# Altium schematic sheet Microcontroller Schematic.SchDoc
size A3; SheetNumber: 3; SheetTotal: 3
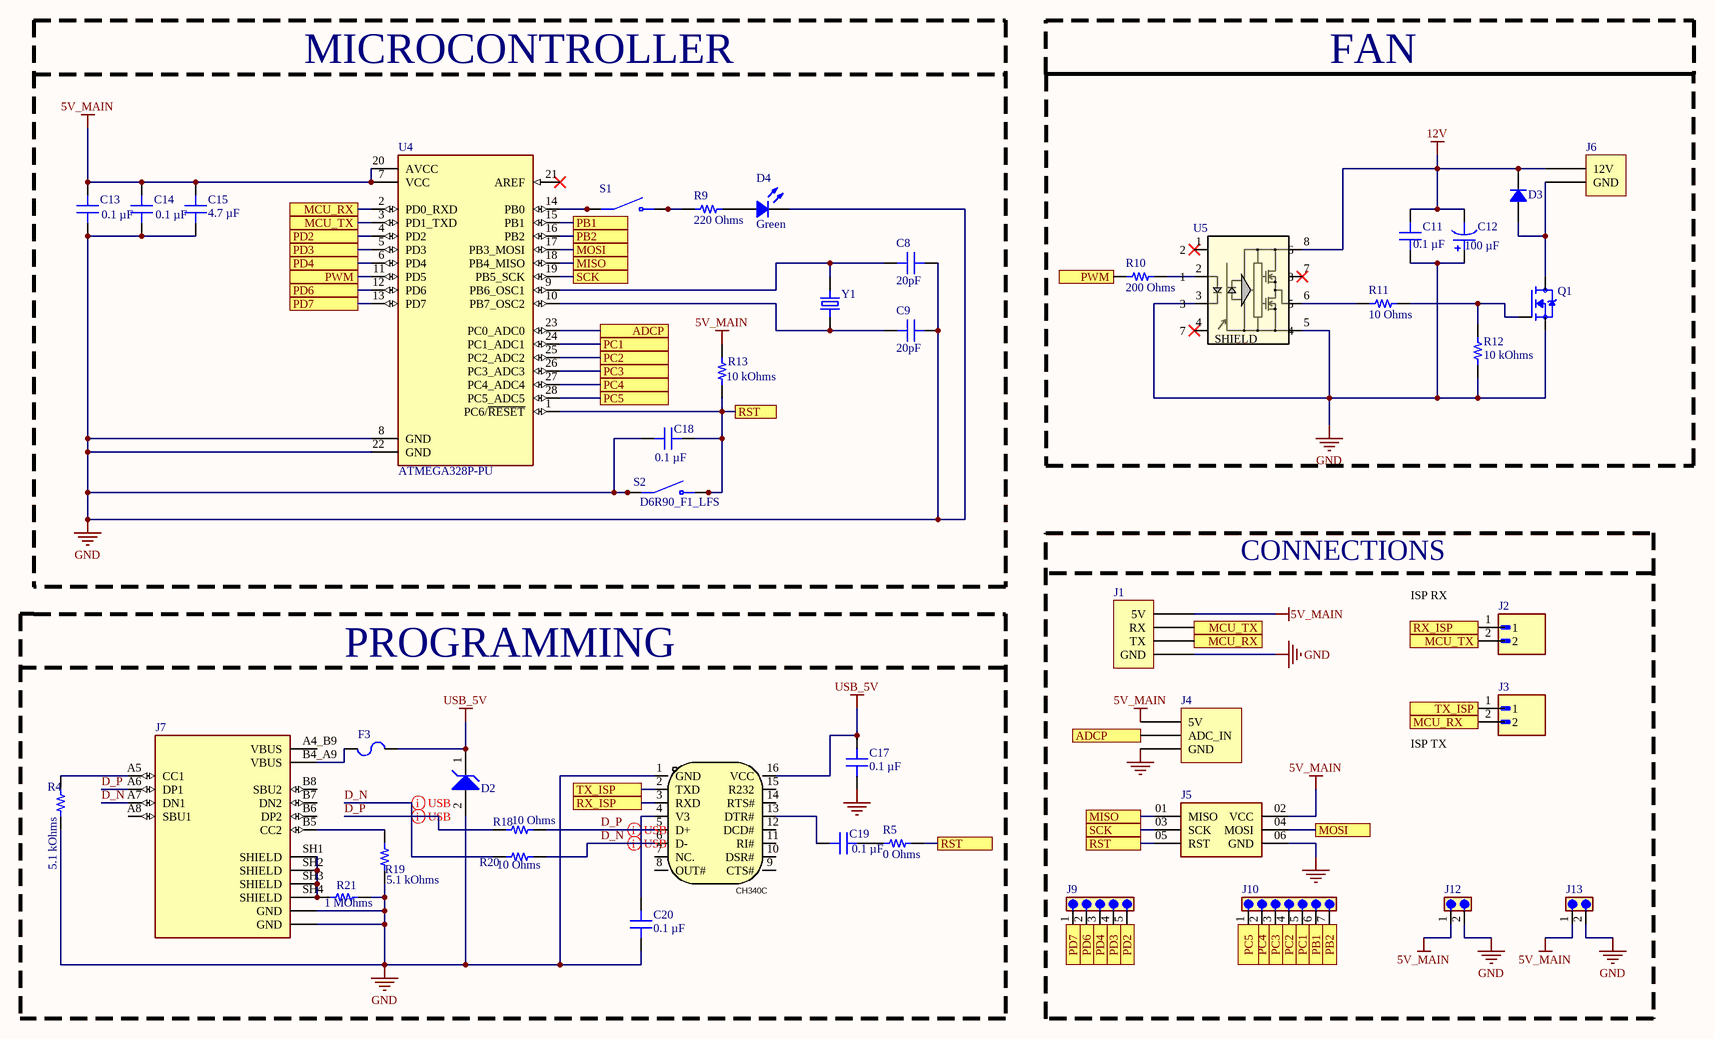
[diagram p0: Microcontroller Schematic.SchDoc]

## Parts
C8  20pF  [CAP 0603_1608]
C9  20pF  [CAP 0603_1608]
C11  0.1 µF  [CAP 0603_1608]
C12  100 µF  [CAP TH ALUM ELEC D8.00mm S3.50mm H16.50mm]
C13  0.1 µF  [CAP 0603_1608]
C14  0.1 µF  [CAP 0603_1608]
C15  4.7 µF  [CAP 0603_1608]
C17  0.1 µF  [CAP 0603_1608]
C18  0.1 µF  [CAP 0603_1608]
C19  0.1 µF  [CAP 0603_1608]
C20  0.1 µF  [CAP 0603_1608]
D2  400W, 5VDC  [WE-TVSP_DO-214AC_Unidirectional]  (value not drawn)
D3  1N4007FLTR  [SOD123F]  (value not drawn)
D4  Green  [LED 0603_1608 GREEN]
F3  SF-1206S300-2  [FUSE 0402_1005 0.51MM]  (value not drawn)
J1  B4B-XH-A(LF)(SN)  [JST XH B4B-XH-A]  (value not drawn)
J2  M20-9990246  [HARWIN_M20-9990246]  (value not drawn)
J3  M20-9990246  [HARWIN_M20-9990246]  (value not drawn)
J4  B3B-XH-A(LF)(SN)  [JST XH B3B-XH-A]  (value not drawn)
J5  TST-103-01-L-D  [SAMTEC_TST-103-01-L-D]  (value not drawn)
J6  B2B-XH-A(LF)(SN)  [JST XH B2B-XH-A]  (value not drawn)
J7  10155435-00011LF  [AMPHENOL_10155435-00011LF]  (value not drawn)
J9  6130XX11121_61300511121  [61300511121]  (value not drawn)
J10  6130XX11121_61300711121  [61300711121]  (value not drawn)
J12  6130XX11121_61300211121  [61300211121]  (value not drawn)
J13  6130XX11121_61300211121  [61300211121]  (value not drawn)
Q1  IRFZ44NSTRLPBF  [DPAK254P1524X483-3N]  (value not drawn)
R4  5.1 kOhms  [YAGEO RES 0603_1608]
R5  0 Ohms  [YAGEO RES 0603_1608]
R9  220 Ohms  [YAGEO RES 0805_2012]
R10  200 Ohms  [YAGEO RES 0603_1608]
R11  10 Ohms  [YAGEO RES 0603_1608]
R12  10 kOhms  [YAGEO RES 0603_1608]
R13  10 kOhms  [YAGEO RES 0603_1608]
R18  10 Ohms  [YAGEO RES 0603_1608]
R19  5.1 kOhms  [YAGEO RES 0603_1608]
R20  10 Ohms  [YAGEO RES 0603_1608]
R21  1 MOhms  [YAGEO RES 0603_1608]
S1  D6R90_F1_LFS  [SW_D6R90_F1_LFS]  (value not drawn)
S2  D6R90_F1_LFS  [SW_D6R90_F1_LFS]
U4  ATMEGA328P-PU  [DIP794W46P254L2967H457Q28B - duplicate]
U5  TLP250H(F)  [DIP8_TOS]  (value not drawn)
U7  CH340C  [CH340C]
Y1  ECS-160-20-5PX-TR  [XTAL_ECS-160-20-5PX-TR]  (value not drawn)

## Blocks framed on the sheet
MICROCONTROLLER: C8 C9 C13-C15 C18 D4 R9 R13 S1 S2 U4 Y1
FAN: C11 C12 D3 J6 Q1 R10-R12 U5
CONNECTIONS: J1-J5 J9 J10 J12 J13
PROGRAMMING: C17 C19 C20 D2 F3 J7 R4 R5 R18-R21 U7

## Ports
ADCP (see Microcontroller Schematic[3A]), ADCP (see Microcontroller Schematic[5C]), MCU_RX (see Microcontroller Schematic[2A], Microcontroller Schematic[5B]), MCU_RX (see Microcontroller Schematic[2A], Microcontroller Schematic[6C]), MCU_RX (see Microcontroller Schematic[5B], Microcontroller Schematic[6C]), MCU_TX (see Microcontroller Schematic[2A], Microcontroller Schematic[5B]), MCU_TX (see Microcontroller Schematic[2A], Microcontroller Schematic[6B]), MCU_TX (see Microcontroller Schematic[5B], Microcontroller Schematic[6B]), MISO (see Microcontroller Schematic[3A]), MISO (see Microcontroller Schematic[5C]), MOSI (see Microcontroller Schematic[3A]), MOSI (see Microcontroller Schematic[6C]), PB1 (see Microcontroller Schematic[3A]), PB1 (see Microcontroller Schematic[6C]), PB2 (see Microcontroller Schematic[3A]), PB2 (see Microcontroller Schematic[6C]), PC1 (see Microcontroller Schematic[3B]), PC1 (see Microcontroller Schematic[6C]), PC2 (see Microcontroller Schematic[3B]), PC2 (see Microcontroller Schematic[6C]), PC3 (see Microcontroller Schematic[3B]), PC3 (see Microcontroller Schematic[6C]), PC4 (see Microcontroller Schematic[3B]), PC4 (see Microcontroller Schematic[6C]), PC5 (see Microcontroller Schematic[3B]), PC5 (see Microcontroller Schematic[6C]), PD2 (see Microcontroller Schematic[2A]), PD2 (see Microcontroller Schematic[5C]), PD3 (see Microcontroller Schematic[2A]), PD3 (see Microcontroller Schematic[5C]), PD4 (see Microcontroller Schematic[2A]), PD4 (see Microcontroller Schematic[5C]), PD6 (see Microcontroller Schematic[2A]), PD6 (see Microcontroller Schematic[5C]), PD7 (see Microcontroller Schematic[2A]), PD7 (see Microcontroller Schematic[5C]), PWM (see Microcontroller Schematic[2A]), PWM (see Microcontroller Schematic[5A]), RST (see Microcontroller Schematic[4B], Microcontroller Schematic[4C]), RST (see Microcontroller Schematic[4B], Microcontroller Schematic[5C]), RST (see Microcontroller Schematic[4C], Microcontroller Schematic[5C]), RX_ISP (see Microcontroller Schematic[3C]), RX_ISP (see Microcontroller Schematic[6B]), SCK (see Microcontroller Schematic[3A]), SCK (see Microcontroller Schematic[5C]), TX_ISP (see Microcontroller Schematic[3C]), TX_ISP (see Microcontroller Schematic[6B])

## Nets
5V_MAIN: C13.2 C14.2 C15.2 J1.1(5V) J4.1(5V) J5.02(VCC) J12.1 J13.1 R13.2 U4.7(VCC) U4.20(AVCC)
12V: C11.2 C12.2 D3.2 J6.1(12V) U5.8(6)
GND: C8.2 C9.2 C11.1 C12.1 C13.1 C14.1 C15.1 C17.2 C18.2 C20.1 D2.2(A) D4.2 J1.4(GND) J4.3(GND) J5.06(GND) J7.A1_B12(GND) J7.B1_A12(GND) J12.2 J13.2 Q1.3(S) R4.1 R12.1 R19.1 R21.2 S2.1(COM) S2.2(COM) U4.8(GND) U4.22(GND) U5.3 U5.5(4) U7.1(GND)
USB_5V: C17.1 D2.1(K) F3.2 U7.16(VCC)
ADCP: J4.2(ADC_IN) U4.23(PC0_ADC0) ; port ADCP
D_N: J7.A7(DN1) R20.1 R20.2 U7.6(D-)
D_P: J7.A6(DP1) R18.1 R18.2 U7.5(D+)
MCU_RX: J1.3(TX) J3.2 U4.2(PD0_RXD) ; port MCU_RX
MCU_TX: J1.2(RX) J2.2 U4.3(PD1_TXD) ; port MCU_TX
MISO: J5.01(MISO) U4.18(PB4_MISO) ; port MISO
MOSI: J5.04(MOSI) U4.17(PB3_MOSI) ; port MOSI
PB1: J10.6 U4.15(PB1) ; port PB1
PB2: J10.7 U4.16(PB2) ; port PB2
PC1: J10.5 U4.24(PC1_ADC1) ; port PC1
PC2: J10.4 U4.25(PC2_ADC2) ; port PC2
PC3: J10.3 U4.26(PC3_ADC3) ; port PC3
PC4: J10.2 U4.27(PC4_ADC4) ; port PC4
PC5: J10.1 U4.28(PC5_ADC5) ; port PC5
PD2: J9.5 U4.4(PD2) ; port PD2
PD3: J9.4 U4.5(PD3) ; port PD3
PD4: J9.3 U4.6(PD4) ; port PD4
PD6: J9.2 U4.12(PD6) ; port PD6
PD7: J9.1 U4.13(PD7) ; port PD7
PWM: R10.1 U4.11(PD5) ; port PWM
RST: C18.1 J5.05(RST) R5.2 R13.1 S2.3(NO) S2.4(NO) U4.1(PC6/~{RESET}) ; port RST
RX_ISP: J2.1 U7.3(RXD) ; port RX_ISP
SCK: J5.03(SCK) U4.19(PB5_SCK) ; port SCK
TX_ISP: J3.1 U7.2(TXD) ; port TX_ISP
NetC8_1: C8.1 U4.9(PB6_OSC1) Y1.2
NetC9_1: C9.1 U4.10(PB7_OSC2) Y1.1
NetC19_1: C19.1 R5.1
NetC19_2: C19.2 U7.13(DTR#)
NetC20_2: C20.2 U7.4(V3)
NetD3_1: D3.1 J6.2(GND) Q1.2(D)
NetD4_1: D4.1 R9.2
NetF3_1: F3.1 J7.B4_A9(VBUS)
NetJ7_A5: J7.A5(CC1) R4.2
NetJ7_B5: J7.B5(CC2) R19.2
NetJ7_SH1: J7.SH1(SHIELD) J7.SH2(SHIELD) J7.SH3(SHIELD) J7.SH4(SHIELD) R21.1
NetQ1_1: Q1.1(G) R11.2 R12.2
NetR9_1: R9.1 S1.3(NO) S1.4(NO)
NetR10_2: R10.2 U5.2(1)
NetR11_1: R11.1 U5.6(5)
NetS1_1: S1.1(COM) S1.2(COM) U4.14(PB0)

Not connected (* = marked no-connect by the designer): J7 A4_B9(VBUS) A8(SBU1) B6(DP2) B7(DN2) B8(SBU2); U4 21(AREF)*; U5 1(2)* 4(7)* 7(8)*; U7 7(NC.) 8(OUT#) 9(CTS#) 10(DSR#) 11(RI#) 12(DCD#) 14(RTS#) 15(R232)

## Layout directives
differential pair: D_N, D_P

## Notes on the sheet
- (near J2) ISP RX
- (near J3) ISP TX
- (in symbol TLP250HF) SHIELD

## Library data of the parts
C8 C9 = 06033A200JAT2A: CAP CER 20PF 25V C0G/NP0 0603; manufacturer: AVX Corporation; Temperature Coefficient: C0G, NP0; Tolerance: ±5%; Part Number: 06033A200JAT2A; Applications: General Purpose; componentlink1description: Datasheet; componentlink1url: http://datasheets.avx.com/C0GNP0-Dielectric.pdf; componentlink2description: DigiKey Link; componentlink2url: http://digikey.com/product-detail/en/avx-corporation/06033A200JAT2A/478-11802-1-ND/8573438; Device Package: 0603 (1608 Metric); lastupdated: 2.09.2020 01:03:34; Lifecycle Status: Active; Minimum Order: 1; Mounting Type: Surface Mount, MLCC; Operating Temperature: -55°C ~ 125°C; Package / Case: 0603 (1608 Metric); packaging: TapeAndReel; partid: 3067; Part Status: Active; price: 0.04; series: -; Size / Dimension: 0.063" L x 0.032" W (1.60mm x 0.81mm); Supplier 1: DigiKey; Supplier Part Number 1: 478-11802-1-ND; Thickness (Max): 0.035" (0.90mm); value: 20pF; Voltage - Rated: 25V; Capacitance: 20pF
C11 C13 C14 C17-C20 = C0603X104M3RAC7867: CAP CER 0.1UF 25V X7R 0603; manufacturer: KEMET; Tolerance: ±20%; Part Number: C0603X104M3RAC7867; Applications: Boardflex Sensitive; componentlink1description: Datasheet; componentlink1url: https://api.kemet.com/component-edge/download/datasheet/C0603X104M3RACTU.pdf; componentlink2description: DigiKey Link; componentlink2url: https://www.digikey.com/en/products/detail/kemet/C0603X104M3RAC7867/2202613; Device Package: 0603 (1608 Metric); Features: Soft Termination; lastupdated: 9.02.2024 20:10:30; Lifecycle Status: Active; Minimum Order: 1; Mounting Type: Surface Mount, MLCC; Operating Temperature: -55°C ~ 125°C; Package / Case: 0603 (1608 Metric); packaging: TapeAndReel; partid: 2484; Part Status: Active; price: 0.06; series: SMD Comm X7R Flex; Size / Dimension: 0.063" L x 0.031" W (1.60mm x 0.80mm); Supplier 1: DigiKey; Supplier Part Number 1: 399-13148-1-ND; Temperature Coefficient: X7R; Thickness (Max): 0.034" (0.87mm); value: 0.1 µF; Voltage - Rated: 25V; Capacitance: 0.1 µF
C12 = EEU-TA1E101: CAP ALUM 100UF 20% 25V RADIAL; manufacturer: Panasonic Electronic Components; Impedance: 130 mOhms; Lifetime @ Temp.: 2000 Hrs @ 125°C; Polarization: Polar; Ripple Current @ High Frequency: 500 mA @ 100 kHz; Ripple Current @ Low Frequency: 325 mA @ 120 Hz; Part Number: EEU-TA1E101; Applications: General Purpose; Capacitance: 100 µF; componentlink1description: Datasheet; componentlink1url: http://industrial.panasonic.com/www-cgi/jvcr13pz.cgi?E+PZ+3+ABA0028+EEUTA1E101+8+WW; componentlink2description: DigiKey Link; componentlink2url: https://www.digikey.com/en/products/detail/panasonic-electronic-components/EEU-TA1E101/2689893; Device Package: Radial, Can; Height - Seated (Max): 0.492" (12.50mm); lastupdated: 3.06.2024 20:06:12; Lead Spacing: 0.138" (3.50mm); Lifecycle Status: Active; Minimum Order: 1; Mounting Type: Through Hole; Operating Temperature: -40°C ~ 125°C; Package / Case: Radial, Can; packaging: Bulk; partid: 7202; Part Status: Active; price: 0.25; series: TA; Size / Dimension: 0.315" Dia (8.00mm); Supplier 1: DigiKey; Supplier Part Number 1: P19501-ND; Tolerance: ±20%; value: 100 µF; Voltage - Rated: 25 V
C15 = CL10A475KA8NQNC: CAP CER 4.7UF 25V X5R 0603; manufacturer: Samsung Electro-Mechanics; Tolerance: ±10%; Part Number: CL10A475KA8NQNC; Applications: General Purpose; componentlink1description: Datasheet; componentlink1url: http://www.samsungsem.com/kr/support/product-search/mlcc/CL10A475KA8NQNC.jsp; componentlink2description: DigiKey Link; componentlink2url: https://www.digikey.com/en/products/detail/samsung-electro-mechanics/CL10A475KA8NQNC/3887558; Device Package: 0603 (1608 Metric); lastupdated: 9.02.2024 20:10:30; Lifecycle Status: Active; Minimum Order: 1; Mounting Type: Surface Mount, MLCC; Operating Temperature: -55°C ~ 85°C; Package / Case: 0603 (1608 Metric); packaging: TapeAndReel; partid: 2349; Part Status: Active; price: 0.06; series: CL; Size / Dimension: 0.063" L x 0.031" W (1.60mm x 0.80mm); Supplier 1: DigiKey; Supplier Part Number 1: 1276-1900-1-ND; Temperature Coefficient: X5R; Thickness (Max): 0.035" (0.90mm); value: 4.7 µF; Voltage - Rated: 25V; Capacitance: 4.7 µF
D2 = 824500500: WE-TVSP SMT Power TVS Diode, DO-214AC, Unidirectional, 400W, 5VDC; Manufacturer: Wurth Elektronik; Clamping Voltage: 9.2V; Operating Voltage (DC): 5V; (Reverse) Breakdown Voltage: 6.7V; (Reverse) Peak Pulse Current: 43.5A; ComponentLink1Description: Website Link; ComponentLink1URL: https://www.we-online.com/redexpert/article/824500500?ad; ComponentLink2Description: Datasheet Link; ComponentLink2URL: https://www.we-online.com/redexpert/spec/824500500?ad; Manufacturer Part Number: 824500500; Category: Surge Protection; Match Code: WE-TVSP; Mount: Surface Mount; Operating Temperature Max: 150°C; Operating Temperature Min: -65°C; Packaging: Tape and Reel; Case/Size Code: DO-214AC; Length: 4.24mm; Width: 2.67mm; Height: 2.25mm; Polarity: Unidirectional; Power Dissipation: 400W
D3 = 1N4007FLTR: STANDARD RECTIFIER 1000V SOD-123; Manufacturer: SMC Diode Solutions; Capacitance @ Vr, F: 15pF @ 4V, 1MHz; Current - Average Rectified (Io): 1A; Current - Reverse Leakage @ Vr: 5µA @ 1000V; Speed: Standard Recovery >500ns, > 200mA (Io); Voltage - Forward (Vf) (Max) @ If: 1.1V @ 1A; Part Number: 1N4007FLTR; ComponentLink1Description: Datasheet; ComponentLink1URL: http://www.smc-diodes.com/propdf/1N4001FL-1N4007FL%20N1646%20REV.A.pdf; ComponentLink2Description: DigiKey Link; ComponentLink2URL: http://digikey.com/product-detail/en/smc-diode-solutions/1N4007FLTR/1655-1N4007FLCT-ND/11657827; Diode Type: Standard; LastUpdated: 30.08.2020 20:59:55; Lifecycle Status: Active; Minimum Order: 1; Mounting Type: Surface Mount; Package / Case: SOD-123F; Packaging: TapeAndReel; PartId: 3314; Price: 0.01; Supplier 1: DigiKey; Supplier Part Number 1: 1655-1N4007FLCT-ND; Supplier Device Package: SOD-123FL; Voltage - DC Reverse (Vr) (Max): 1000V
D4 = LT Q99G.01-R2T1-25-1: NEXT GENERATION OF CHIP LED 0603; Manufacturer: ams-OSRAM USA Inc.; Current - Test: 5mA; Lens Color: Colorless; Lens Size: 1.10mm x 0.80mm; Lens Style: Rectangle with Flat Top; Lens Transparency: Clear; Millicandela Rating: 247.5mcd; Viewing Angle: 140°; Voltage - Forward (Vf) (Typ): 2.9V; Wavelength - Dominant: 530nm; Wavelength - Peak: 518nm; Part Number: LT Q99G.01-R2T1-25-1; Color: Green; ComponentLink2Description: DigiKey Link; ComponentLink2URL: https://www.digikey.com/en/products/detail/ams-osram-usa-inc/LT-Q99G-01-R2T1-25-1/21556499; Device Package: 0603 (1608 Metric); Height (Max): 0.75mm; LastUpdated: 3.06.2024 19:58:39; Lifecycle Status: Active; Minimum Order: 1; Mounting Type: Surface Mount; Package / Case: 0603 (1608 Metric); Packaging: TapeAndReel; PartId: 1419; Price: 0.03; Series: Chip LED 0603; Size / Dimension: 1.60mm L x 0.80mm W; Supplier 1: DigiKey; Supplier Part Number 1: 475-LTQ99G.01-R2T1-25-1CT-ND; Supplier Device Package: 0603; Value: Green
F3 = SF-1206S300-2: FUSE BOARD MOUNT 3A 32VDC 1206; Part Number: SF-1206S300-2
J1 = B4B-XH-A(LF)(SN): CONN HEADER VERT 4POS 2.5MM; Manufacturer: JST Sales America Inc.; Contact Length - Post: 0.134" (3.40mm); Current Rating (Amps): 3A; Material Flammability Rating: UL94 V-0; Number of Positions: 4; Number of Positions Loaded: All; Pitch - Mating: 0.098" (2.50mm); Shrouding: Shrouded - 4 Wall; Style: Board to Cable/Wire; Voltage Rating: 250V; Part Number: B4B-XH-A(LF)(SN); ComponentLink1Description: Datasheet; ComponentLink1URL: http://www.jst-mfg.com/product/pdf/eng/eXH.pdf; ComponentLink2Description: DigiKey Link; ComponentLink2URL: http://digikey.com/product-detail/en/jst-sales-america-inc/B4B-XH-A-LF-SN/455-2249-ND/1651047; Connector Type: Header; Contact Finish - Mating: Tin; Contact Finish - Post: Tin; Contact Material: Brass; Contact Shape: Square; Contact Type: Male Pin; Fastening Type: Detent Lock; Insulation Color: Natural; Insulation Height: 0.276" (7.00mm); Insulation Material: Polyamide (PA66), Nylon 6/6; LastUpdated: 12.01.2020 23:46:34; Lifecycle Status: Active; Minimum Order: 1; Mounting Type: Through Hole; Number of Rows: 1; Operating Temperature: -25°C ~ 85°C; Packaging: Bulk; PartId: 69; Part Status: Active; Price: 0.21; Series: XH; Supplier 1: DigiKey; Supplier Part Number 1: 455-2249-ND; Termination: Press-Fit, Solder
J2 J3 = M20-9990246: 2.54mm (0.1) Pitch SIL Vertical Throughboard Pin Header, 6.1mm mating pin height, tin, 2 contacts; MF: Harwin; SnapEDA_Link: https://www.snapeda.com/parts/M20-9990246/Harwin/view-part/?ref=snap; Package: None; Value: *; MP: M20-9990246; Check_prices: https://www.snapeda.com/parts/M20-9990246/Harwin/view-part/?ref=eda
J4 = B3B-XH-A(LF)(SN): CONN HEADER VERT 3POS 2.5MM; Manufacturer: JST Sales America Inc.; Contact Length - Post: 0.134" (3.40mm); Current Rating (Amps): 3A; Material Flammability Rating: UL94 V-0; Number of Positions: 3; Number of Positions Loaded: All; Pitch - Mating: 0.098" (2.50mm); Shrouding: Shrouded - 4 Wall; Style: Board to Cable/Wire; Voltage Rating: 250V; Part Number: B3B-XH-A(LF)(SN); ComponentLink1Description: Datasheet; ComponentLink1URL: http://www.jst-mfg.com/product/pdf/eng/eXH.pdf; ComponentLink2Description: DigiKey Link; ComponentLink2URL: http://digikey.com/product-detail/en/jst-sales-america-inc/B3B-XH-A-LF-SN/455-2248-ND/1651046; Connector Type: Header; Contact Finish - Mating: Tin; Contact Finish - Post: Tin; Contact Material: Brass; Contact Shape: Square; Contact Type: Male Pin; Fastening Type: Detent Lock; Insulation Color: Natural; Insulation Height: 0.276" (7.00mm); Insulation Material: Polyamide (PA66), Nylon 6/6; LastUpdated: 12.01.2020 23:46:22; Lifecycle Status: Active; Minimum Order: 1; Mounting Type: Through Hole; Number of Rows: 1; Operating Temperature: -25°C ~ 85°C; Packaging: Bulk; PartId: 68; Part Status: Active; Price: 0.19; Series: XH; Supplier 1: DigiKey; Supplier Part Number 1: 455-2248-ND; Termination: Press-Fit, Solder
J5 = TST-103-01-L-D: Connector Header Through Hole 6 position 0.100 _2.54mm_; MF: Samtec; MP: TST-103-01-L-D; SnapEDA_Link: https://www.snapeda.com/parts/TST-103-01-L-D/Samtec/view-part/3264916/?ref=snap; Value: *; Package: None; Price: None; Availability: Unavailable; Toby_UK-Purchase-URL: https://snapeda.com/shop?store=Toby+UK&id=3264916
J6 = B2B-XH-A(LF)(SN): CONN HEADER VERT 2POS 2.5MM; Manufacturer: JST Sales America Inc.; Contact Length - Post: 0.134" (3.40mm); Current Rating (Amps): 3A; Material Flammability Rating: UL94 V-0; Number of Positions: 2; Number of Positions Loaded: All; Pitch - Mating: 0.098" (2.50mm); Shrouding: Shrouded - 4 Wall; Style: Board to Cable/Wire; Voltage Rating: 250V; Part Number: B2B-XH-A(LF)(SN); ComponentLink1Description: Datasheet; ComponentLink1URL: http://www.jst-mfg.com/product/pdf/eng/eXH.pdf; ComponentLink2Description: DigiKey Link; ComponentLink2URL: http://digikey.com/product-detail/en/jst-sales-america-inc/B2B-XH-A-LF-SN/455-2247-ND/1651045; Connector Type: Header; Contact Finish - Mating: Tin; Contact Finish - Post: Tin; Contact Material: Brass; Contact Shape: Square; Contact Type: Male Pin; Fastening Type: Detent Lock; Insulation Color: Natural; Insulation Height: 0.276" (7.00mm); Insulation Material: Polyamide (PA66), Nylon 6/6; LastUpdated: 12.01.2020 23:46:08; Lifecycle Status: Active; Minimum Order: 1; Mounting Type: Through Hole; Number of Rows: 1; Operating Temperature: -25°C ~ 85°C; Packaging: Bulk; PartId: 67; Part Status: Active; Price: 0.15; Series: XH; Supplier 1: DigiKey; Supplier Part Number 1: 455-2247-ND; Termination: Press-Fit, Solder
J7 = 10155435-00011LF: USB-C (USB TYPE-C) Receptacle Connector 24 (16+8 Dummy) Position Surface Mount, Right Angle; Manufacturer: AMPHENOL ICC (FCI); Package: None; Price: None; Value: *; MP: 10155435-00011LF; Availability: Unavailable; Supplier 1: Newark; Manufacturer Part Number: 10155435-00011LF; RoHS: No; Supplier Part Number 1: 04AJ5525
J9 = 6130XX11121_61300511121: MF: {'manufacturer': u'W\xfcrth Elektronik'}; Package: None; Price: None; Value: *; MP: 61300511121; Availability: Unavailable
J10 = 6130XX11121_61300711121: MF: {'manufacturer': u'Wurth Electronics'}; Package: None; Price: None; Value: *; MP: 61300711121; Availability: Unavailable
J12 J13 = 6130XX11121_61300211121: MF: {'manufacturer': u'Wurth Electronics'}; Package: None; Price: None; Value: *; MP: 61300211121; Availability: Unavailable
Q1 = IRFZ44NSTRLPBF: RoHS Compliant | Low RDS(on) | Industry-leading quality | Dynamic dv/dt Rating | Fast Switching | Fully Avalanche Rated | 175C Operating Temperature; MF: Infineon Technologies; SnapEDA_Link: https://www.snapeda.com/parts/IRFZ44NSTRLPBF/Infineon+Technologies/view-part/?ref=snap; Package: D2PAK Infineon; Value: *; MP: IRFZ44NSTRLPBF; Check_prices: https://www.snapeda.com/parts/IRFZ44NSTRLPBF/Infineon+Technologies/view-part/?ref=eda
R4 R19 = RT0603FRE075K1L: RES SMD 5.1K OHM 1% 1/10W 0603; Manufacturer: Yageo; Power (Watts): 0.1W, 1/10W; Temperature Coefficient: ±50ppm/°C; Part Number: RT0603FRE075K1L; ComponentLink1Description: Datasheet; ComponentLink1URL: https://www.yageo.com/upload/media/product/productsearch/datasheet/rchip/PYu-RT_1-to-0.01_RoHS_L_11.pdf; ComponentLink2Description: DigiKey Link; ComponentLink2URL: https://www.digikey.com/en/products/detail/yageo/RT0603FRE075K1L/1075435; Composition: Thin Film; Device Package: 0603 (1608 Metric); Height - Seated (Max): 0.022" (0.55mm); LastUpdated: 25.07.2024 09:19:25; Lifecycle Status: Active; Minimum Order: 1; Number of Terminations: 2; Operating Temperature: -55°C ~ 155°C; Package / Case: 0603 (1608 Metric); Packaging: TapeAndReel; PartId: 16011; Part Status: Active; Price: 0.01; Resistance: 5.1 kOhms; Series: RT; Size / Dimension: 0.063" L x 0.031" W (1.60mm x 0.80mm); Supplier 1: DigiKey; Supplier Part Number 1: YAG5966CT-ND; Supplier Device Package: 0603; Tolerance: ±1%; Value: 5.1 kOhms
R5 = HCJ0603ZT0R00: RES 0 OHM JUMPER 1/4W 0603; Manufacturer: Stackpole Electronics Inc; Power (Watts): 0.25W, 1/4W; Part Number: HCJ0603ZT0R00; ComponentLink1Description: Datasheet; ComponentLink1URL: https://www.seielect.com/catalog/sei-hcj.pdf; ComponentLink2Description: DigiKey Link; ComponentLink2URL: https://www.digikey.com/en/products/detail/stackpole-electronics-inc/HCJ0603ZT0R00/4357660; Composition: Metal Foil; Device Package: 0603 (1608 Metric); Features: Automotive AEC-Q200; Height - Seated (Max): 0.018" (0.45mm); LastUpdated: 9.02.2024 20:43:15; Lifecycle Status: Active; Minimum Order: 1; Number of Terminations: 2; Operating Temperature: -55°C ~ 155°C; Package / Case: 0603 (1608 Metric); Packaging: TapeAndReel; PartId: 10189; Part Status: Active; Price: 0.06; Ratings: AEC-Q200; Resistance: 0 Ohms; Series: HCJ; Size / Dimension: 0.061" L x 0.031" W (1.55mm x 0.80mm); Supplier 1: DigiKey; Supplier Part Number 1: HCJ0603ZT0R00CT-ND; Supplier Device Package: 0603; Tolerance: Jumper; Value: 0 Ohms
R9 = AC0805FR-7W220RL: RES 220 OHM 1% 1/4W 0805; Manufacturer: Yageo; Power (Watts): 0.25W, 1/4W; Temperature Coefficient: ±100ppm/°C; Part Number: AC0805FR-7W220RL; ComponentLink1Description: Datasheet; ComponentLink1URL: https://www.yageo.com/upload/media/product/productsearch/datasheet/rchip/PYu-AC_51_RoHS_L_10.pdf; ComponentLink2Description: DigiKey Link; ComponentLink2URL: https://www.digikey.com/en/products/detail/yageo/AC0805FR-7W220RL/17022423; Composition: Thick Film; Device Package: 0805 (2012 Metric); Features: Automotive AEC-Q200, Moisture Resistant; Height - Seated (Max): 0.024" (0.60mm); LastUpdated: 25.07.2024 09:19:55; Lifecycle Status: Active; Minimum Order: 1; Number of Terminations: 2; Operating Temperature: -55°C ~ 155°C; Package / Case: 0805 (2012 Metric); Packaging: TapeAndReel; PartId: 87434; Price: 0.01; Ratings: AEC-Q200; Resistance: 220 Ohms; Series: AC; Size / Dimension: 0.079" L x 0.049" W (2.00mm x 1.25mm); Supplier 1: DigiKey; Supplier Part Number 1: 13-AC0805FR-7W220RLCT-ND; Supplier Device Package: 0805; Tolerance: ±1%; Value: 220 Ohms
R10 = RT0603BRD07200RL: RES SMD 200 OHM 0.1% 1/10W 0603; Manufacturer: Yageo; Power (Watts): 0.1W, 1/10W; Temperature Coefficient: ±25ppm/°C; Part Number: RT0603BRD07200RL; ComponentLink1Description: Datasheet; ComponentLink1URL: https://www.yageo.com/upload/media/product/productsearch/datasheet/rchip/PYu-RT_1-to-0.01_RoHS_L_11.pdf; ComponentLink2Description: DigiKey Link; ComponentLink2URL: https://www.digikey.com/en/products/detail/yageo/RT0603BRD07200RL/1072346; Composition: Thin Film; Device Package: 0603 (1608 Metric); Height - Seated (Max): 0.022" (0.55mm); LastUpdated: 25.07.2024 09:19:29; Lifecycle Status: Active; Minimum Order: 1; Number of Terminations: 2; Operating Temperature: -55°C ~ 155°C; Package / Case: 0603 (1608 Metric); Packaging: TapeAndReel; PartId: 10314; Part Status: Active; Price: 0.03; Resistance: 200 Ohms; Series: RT; Size / Dimension: 0.063" L x 0.031" W (1.60mm x 0.80mm); Supplier 1: DigiKey; Supplier Part Number 1: YAG1579CT-ND; Supplier Device Package: 0603; Tolerance: ±0.1%; Value: 200 Ohms
R11 R18 R20 = AC0603FR-0710RL: RES SMD 10 OHM 1% 1/10W 0603; Manufacturer: Yageo; Power (Watts): 0.1W, 1/10W; Temperature Coefficient: ±100ppm/°C; Part Number: AC0603FR-0710RL; ComponentLink1Description: Datasheet; ComponentLink1URL: https://www.yageo.com/upload/media/product/productsearch/datasheet/rchip/PYu-AC_51_RoHS_L_7.pdf; ComponentLink2Description: DigiKey Link; ComponentLink2URL: https://www.digikey.com/en/products/detail/yageo/AC0603FR-0710RL/2828512; Composition: Thick Film; Device Package: 0603 (1608 Metric); Features: Automotive AEC-Q200, Moisture Resistant; Height - Seated (Max): 0.022" (0.55mm); LastUpdated: 25.07.2024 09:19:31; Lifecycle Status: Active; Minimum Order: 1; Number of Terminations: 2; Operating Temperature: -55°C ~ 155°C; Package / Case: 0603 (1608 Metric); Packaging: TapeAndReel; PartId: 8121; Part Status: Active; Price: 0.01; Ratings: AEC-Q200; Resistance: 10 Ohms; Series: AC; Size / Dimension: 0.063" L x 0.031" W (1.60mm x 0.80mm); Supplier 1: DigiKey; Supplier Part Number 1: 311-10LDCT-ND; Supplier Device Package: 0603; Tolerance: ±1%; Value: 10 Ohms
R12 R13 = RT0603FRE0710KL: RES SMD 10K OHM 1% 1/10W 0603; Manufacturer: Yageo; Power (Watts): 0.1W, 1/10W; Temperature Coefficient: ±50ppm/°C; Part Number: RT0603FRE0710KL; ComponentLink1Description: Datasheet; ComponentLink1URL: https://www.yageo.com/upload/media/product/productsearch/datasheet/rchip/PYu-RT_1-to-0.01_RoHS_L_11.pdf; ComponentLink2Description: DigiKey Link; ComponentLink2URL: https://www.digikey.com/en/products/detail/yageo/RT0603FRE0710KL/1075040; Composition: Thin Film; Device Package: 0603 (1608 Metric); Height - Seated (Max): 0.022" (0.55mm); LastUpdated: 25.07.2024 09:19:32; Lifecycle Status: Active; Minimum Order: 1; Number of Terminations: 2; Operating Temperature: -55°C ~ 155°C; Package / Case: 0603 (1608 Metric); Packaging: TapeAndReel; PartId: 5671; Part Status: Active; Price: 0.01; Resistance: 10 kOhms; Series: RT; Size / Dimension: 0.063" L x 0.031" W (1.60mm x 0.80mm); Supplier 1: DigiKey; Supplier Part Number 1: YAG2321CT-ND; Supplier Device Package: 0603; Tolerance: ±1%; Value: 10 kOhms
R21 = CRCW06031M00JNEAHP: RES SMD 1M OHM 5% 1/3W 0603; Manufacturer: Vishay Dale; Power (Watts): 0.333W, 1/3W; Temperature Coefficient: ±200ppm/°C; Part Number: CRCW06031M00JNEAHP; ComponentLink1Description: Datasheet; ComponentLink1URL: http://www.vishay.com/docs/20043/crcwhpe3.pdf; ComponentLink2Description: DigiKey Link; ComponentLink2URL: https://www.digikey.com/en/products/detail/vishay-dale/CRCW06031M00JNEAHP/2222314; Composition: Thick Film; Device Package: 0603 (1608 Metric); Features: Automotive AEC-Q200, Pulse Withstanding; Height - Seated (Max): 0.022" (0.55mm); LastUpdated: 9.02.2024 20:42:32; Lifecycle Status: Active; Minimum Order: 1; Number of Terminations: 2; Operating Temperature: -55°C ~ 155°C; Package / Case: 0603 (1608 Metric); Packaging: TapeAndReel; PartId: 21324; Part Status: Active; Price: 0.01; Ratings: AEC-Q200; Resistance: 1 MOhms; Series: CRCW-HP; Size / Dimension: 0.063" L x 0.033" W (1.60mm x 0.85mm); Supplier 1: DigiKey; Supplier Part Number 1: 541-1.0MSACT-ND; Supplier Device Package: 0603; Tolerance: ±5%; Value: 1 MOhms
S1 S2 = D6R90_F1_LFS: Pushbutton Switch SPST-NO Keyswitch Through Hole; Package: None; Price: None; Value: *; MP: D6R90_F1_LFS; Availability: Unavailable
U4 = ATMEGA328P-PU: ATmega Series 20 MHz 32 KB Flash 2 KB SRAM 8-Bit Microcontroller - DIP-28; MP: ATMEGA328P-PU; Package: None; Availability: Unavailable; Price: None; Value: *
U5 = TLP250HF: Photocoupler (photo-IC output), IGBT driver, IOP=+/-2.5 A, 3750 Vrms, DIP8; Manufacturer_Name: Toshiba Electronic Devices & Storage Corp.; Number_devices_in_Package: 1; Copyright: Copyright (C) 2025 Ultra Librarian. All rights reserved.; Manufacturer_Part_Number: TLP250H(F); Datasheet: https://toshiba.semicon-storage.com/info/docget.jsp?did=13872&prodName=TLP250H; Source_Package: TLP250H; RefDes: Refdes; Type: Type
U7 = CH340C: Manufacturer: WCH(南京沁恒); Add into BOM: yes; Applications Function: Transceiver; USB Protocol: USB 2.0; Voltage - Supply: 3.3V；5V; Data Rate: 2Mbps; Symbol: CH340C; Device: CH340C; LCSC Part Name: CH340C; Supplier Part: C84681; Manufacturer Part: CH340C; Supplier Footprint: SOP-16; JLCPCB Part Class: Extended Part; Datasheet: https://atta.szlcsc.com/upload/public/pdf/source/20250604/33626338A5406B1E2A8163A86C0531AF.pdf; Supplier: LCSC; Convert to PCB: yes
Y1 = ECS-160-20-5PX-TR: 16 MHz Â±30ppm Crystal 20pF 40 Ohms HC-49/US; MF: ECS Inc.; SnapEDA_Link: https://www.snapeda.com/parts/ECS-160-20-5PX-TR/ECS/view-part/?ref=snap; Package: CSM-7X-3L-5G3X-2 ECS; Value: *; MP: ECS-160-20-5PX-TR; Check_prices: https://www.snapeda.com/parts/ECS-160-20-5PX-TR/ECS/view-part/?ref=eda